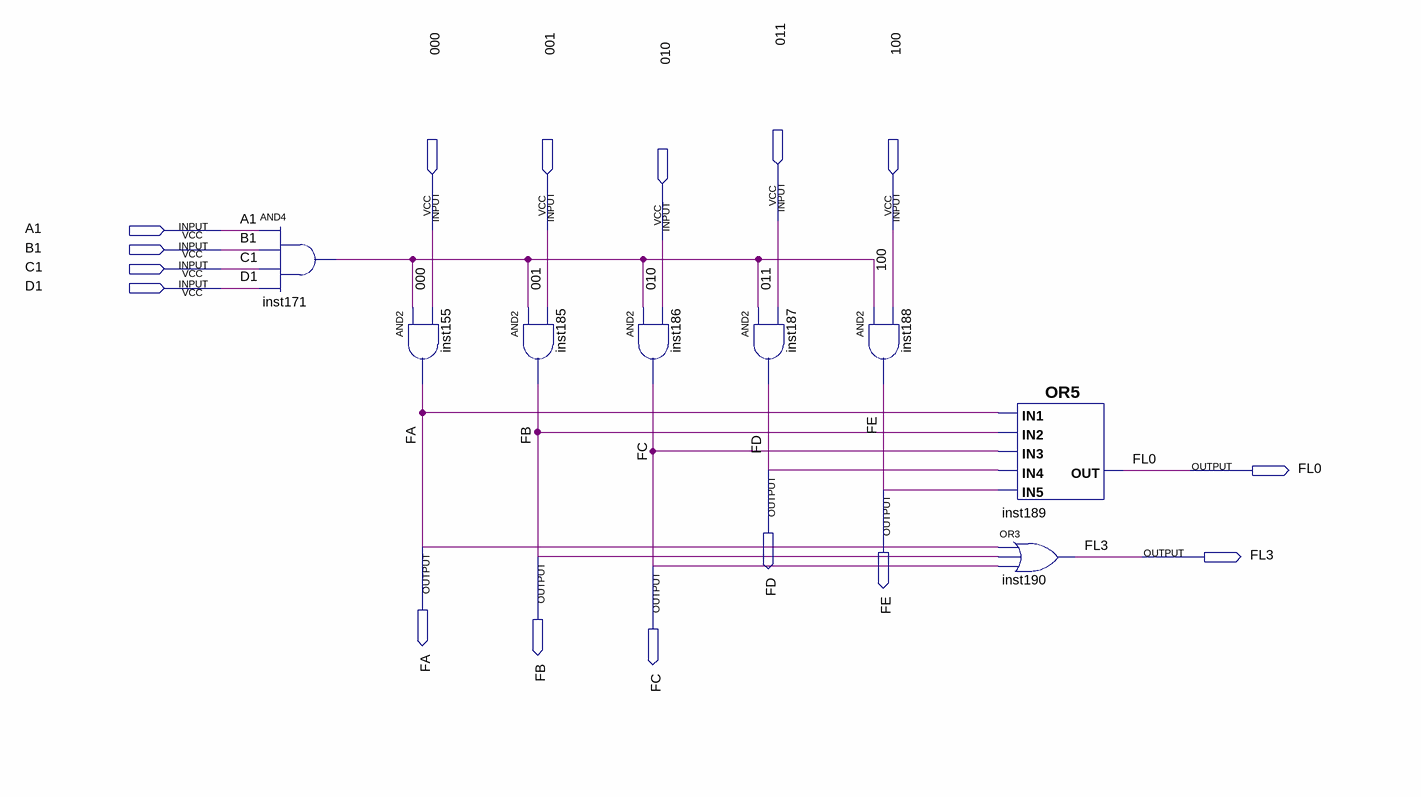
[diagram p0: schematic sheet]
// Quartus schematic caracF.bdf as structural Verilog: 8 symbols, 16 pins
module caracF (
  input  \011 ,
  input  A1,
  input  \000 ,
  input  \001 ,
  input  \100 ,
  input  \010 ,
  input  B1,
  input  C1,
  input  D1,
  output FD,
  output FL0,
  output FE,
  output FA,
  output FB,
  output FL3,
  output FC
);

  wire inst171_out;

  and inst171 (inst171_out, A1, B1, C1, D1);
  and inst155 (FA, inst171_out, \000 );
  and inst185 (FB, inst171_out, \001 );
  and inst186 (FC, inst171_out, \010 );
  and inst187 (FD, inst171_out, \011 );
  and inst188 (FE, inst171_out, \100 );
  or inst189 (FL0, FA, FB, FC, FD, FE);
  or inst190 (FL3, FA, FB, FC);
endmodule
